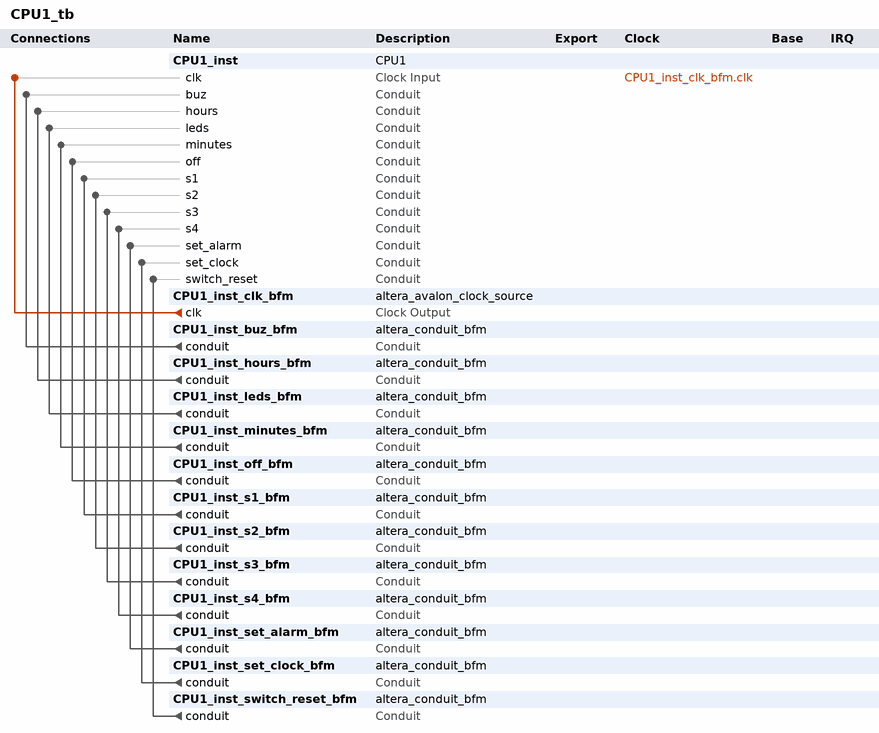
[diagram p0: system contents]
# Platform Designer (Qsys) system CPU1_tb, Cyclone V 5CSEMA5F31C6
# Parameters at their usual value, and those the tool derives, are not listed.
package require -exact qsys 18.1
create_system CPU1_tb
set_project_property DEVICE_FAMILY {Cyclone V}
set_project_property DEVICE 5CSEMA5F31C6

add_instance CPU1_inst CPU1 1.0

add_instance CPU1_inst_clk_bfm altera_avalon_clock_source 18.1

add_instance CPU1_inst_buz_bfm altera_conduit_bfm 18.1
set_instance_parameter_value CPU1_inst_buz_bfm CLOCKED_SIGNAL false
set_instance_parameter_value CPU1_inst_buz_bfm ENABLE_RESET false
set_instance_parameter_value CPU1_inst_buz_bfm SIGNAL_DIRECTIONS input
set_instance_parameter_value CPU1_inst_buz_bfm SIGNAL_WIDTHS 1

add_instance CPU1_inst_hours_bfm altera_conduit_bfm 18.1
set_instance_parameter_value CPU1_inst_hours_bfm CLOCKED_SIGNAL false
set_instance_parameter_value CPU1_inst_hours_bfm ENABLE_RESET false
set_instance_parameter_value CPU1_inst_hours_bfm SIGNAL_DIRECTIONS output
set_instance_parameter_value CPU1_inst_hours_bfm SIGNAL_WIDTHS 1

add_instance CPU1_inst_leds_bfm altera_conduit_bfm 18.1
set_instance_parameter_value CPU1_inst_leds_bfm CLOCKED_SIGNAL false
set_instance_parameter_value CPU1_inst_leds_bfm ENABLE_RESET false
set_instance_parameter_value CPU1_inst_leds_bfm SIGNAL_DIRECTIONS input
set_instance_parameter_value CPU1_inst_leds_bfm SIGNAL_WIDTHS 2

add_instance CPU1_inst_minutes_bfm altera_conduit_bfm 18.1
set_instance_parameter_value CPU1_inst_minutes_bfm CLOCKED_SIGNAL false
set_instance_parameter_value CPU1_inst_minutes_bfm ENABLE_RESET false
set_instance_parameter_value CPU1_inst_minutes_bfm SIGNAL_DIRECTIONS output
set_instance_parameter_value CPU1_inst_minutes_bfm SIGNAL_WIDTHS 1

add_instance CPU1_inst_off_bfm altera_conduit_bfm 18.1
set_instance_parameter_value CPU1_inst_off_bfm CLOCKED_SIGNAL false
set_instance_parameter_value CPU1_inst_off_bfm ENABLE_RESET false
set_instance_parameter_value CPU1_inst_off_bfm SIGNAL_DIRECTIONS output
set_instance_parameter_value CPU1_inst_off_bfm SIGNAL_WIDTHS 1

add_instance CPU1_inst_s1_bfm altera_conduit_bfm 18.1
set_instance_parameter_value CPU1_inst_s1_bfm CLOCKED_SIGNAL false
set_instance_parameter_value CPU1_inst_s1_bfm ENABLE_RESET false
set_instance_parameter_value CPU1_inst_s1_bfm SIGNAL_DIRECTIONS input
set_instance_parameter_value CPU1_inst_s1_bfm SIGNAL_WIDTHS 7

add_instance CPU1_inst_s2_bfm altera_conduit_bfm 18.1
set_instance_parameter_value CPU1_inst_s2_bfm CLOCKED_SIGNAL false
set_instance_parameter_value CPU1_inst_s2_bfm ENABLE_RESET false
set_instance_parameter_value CPU1_inst_s2_bfm SIGNAL_DIRECTIONS input
set_instance_parameter_value CPU1_inst_s2_bfm SIGNAL_WIDTHS 7

add_instance CPU1_inst_s3_bfm altera_conduit_bfm 18.1
set_instance_parameter_value CPU1_inst_s3_bfm CLOCKED_SIGNAL false
set_instance_parameter_value CPU1_inst_s3_bfm ENABLE_RESET false
set_instance_parameter_value CPU1_inst_s3_bfm SIGNAL_DIRECTIONS input
set_instance_parameter_value CPU1_inst_s3_bfm SIGNAL_WIDTHS 7

add_instance CPU1_inst_s4_bfm altera_conduit_bfm 18.1
set_instance_parameter_value CPU1_inst_s4_bfm CLOCKED_SIGNAL false
set_instance_parameter_value CPU1_inst_s4_bfm ENABLE_RESET false
set_instance_parameter_value CPU1_inst_s4_bfm SIGNAL_DIRECTIONS input
set_instance_parameter_value CPU1_inst_s4_bfm SIGNAL_WIDTHS 7

add_instance CPU1_inst_set_alarm_bfm altera_conduit_bfm 18.1
set_instance_parameter_value CPU1_inst_set_alarm_bfm CLOCKED_SIGNAL false
set_instance_parameter_value CPU1_inst_set_alarm_bfm ENABLE_RESET false
set_instance_parameter_value CPU1_inst_set_alarm_bfm SIGNAL_DIRECTIONS output
set_instance_parameter_value CPU1_inst_set_alarm_bfm SIGNAL_WIDTHS 1

add_instance CPU1_inst_set_clock_bfm altera_conduit_bfm 18.1
set_instance_parameter_value CPU1_inst_set_clock_bfm CLOCKED_SIGNAL false
set_instance_parameter_value CPU1_inst_set_clock_bfm ENABLE_RESET false
set_instance_parameter_value CPU1_inst_set_clock_bfm SIGNAL_DIRECTIONS output
set_instance_parameter_value CPU1_inst_set_clock_bfm SIGNAL_WIDTHS 1

add_instance CPU1_inst_switch_reset_bfm altera_conduit_bfm 18.1
set_instance_parameter_value CPU1_inst_switch_reset_bfm CLOCKED_SIGNAL false
set_instance_parameter_value CPU1_inst_switch_reset_bfm ENABLE_RESET false
set_instance_parameter_value CPU1_inst_switch_reset_bfm SIGNAL_DIRECTIONS output
set_instance_parameter_value CPU1_inst_switch_reset_bfm SIGNAL_WIDTHS 1

# connections
add_connection CPU1_inst_clk_bfm.clk CPU1_inst.clk clock
add_connection CPU1_inst_buz_bfm.conduit CPU1_inst.buz conduit
add_connection CPU1_inst_hours_bfm.conduit CPU1_inst.hours conduit
add_connection CPU1_inst_leds_bfm.conduit CPU1_inst.leds conduit
add_connection CPU1_inst_minutes_bfm.conduit CPU1_inst.minutes conduit
add_connection CPU1_inst_off_bfm.conduit CPU1_inst.off conduit
add_connection CPU1_inst_s1_bfm.conduit CPU1_inst.s1 conduit
add_connection CPU1_inst_s2_bfm.conduit CPU1_inst.s2 conduit
add_connection CPU1_inst_s3_bfm.conduit CPU1_inst.s3 conduit
add_connection CPU1_inst_s4_bfm.conduit CPU1_inst.s4 conduit
add_connection CPU1_inst_set_alarm_bfm.conduit CPU1_inst.set_alarm conduit
add_connection CPU1_inst_set_clock_bfm.conduit CPU1_inst.set_clock conduit
add_connection CPU1_inst_switch_reset_bfm.conduit CPU1_inst.switch_reset conduit

set_interconnect_requirement {$system} qsys_mm.clockCrossingAdapter HANDSHAKE
set_interconnect_requirement {$system} qsys_mm.enableEccProtection FALSE
set_interconnect_requirement {$system} qsys_mm.insertDefaultSlave FALSE
set_interconnect_requirement {$system} qsys_mm.maxAdditionalLatency 1

save_system CPU1_tb.qsys
